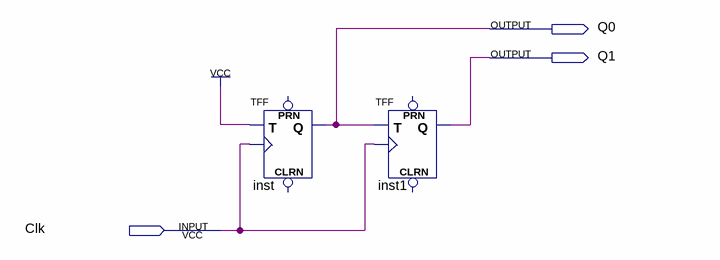
[diagram p0: schematic sheet]
// Quartus schematic Scaner.bdf as structural Verilog: 2 symbols, 3 pins
module Scaner (
  input  Clk,
  output Q0,
  output Q1
);

  TFF inst (.T(1'b1), .CLK(Clk), .Q(Q0));  // open: PRN, CLRN
  TFF inst1 (.T(Q0), .CLK(Clk), .Q(Q1));  // open: PRN, CLRN
endmodule
